# Altium schematic sheet Anemometor_ResDiv1.SchDoc
size 152 x 127 mm; SheetNumber: 7; SheetTotal: 11
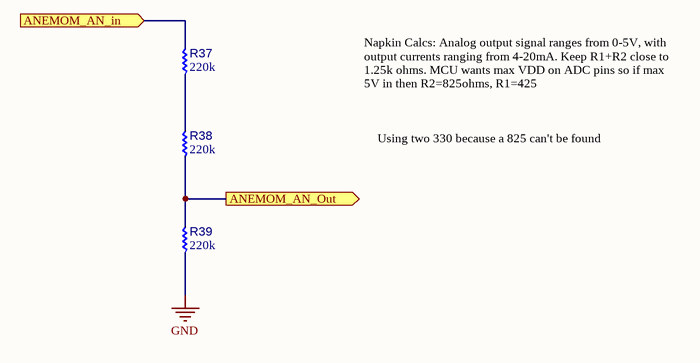
[diagram p0: Anemometor_ResDiv1.SchDoc]

## Parts
R37  value 220k  [New footprint 1]  (hidden comment: RMCF0603FT220K)
R38  value 220k  [New footprint 1]  (hidden comment: RMCF0603FT220K)
R39  value 220k  [New footprint 1]  (hidden comment: RMCF0603FT220K)

## Ports
ANEMOM_AN_in (in, see TopLevel[1A]), ANEMOM_AN_Out (out, see TopLevel[1A])

## Nets
GND: R39.1
ANEMOM_AN_in: R37.2 ; port ANEMOM_AN_in
ANEMOM_AN_Out: R38.1 R39.2 ; port ANEMOM_AN_Out
NetR37_1: R37.1 R38.2

## Notes on the sheet
- Napkin Calcs: Analog output signal ranges from 0-5V, with output currents ranging from 4-20mA. Keep R1+R2 close to 1.25k ohms. MCU wants max VDD on ADC pins so if max 5V in then R2=825ohms, R1=425
- Using two 330 because a 825 can't be found

## Library data of the parts
R37-R39 = CMP-009-00365-1: Res Thick Film 0603 220K Ohm 1% 0.1W(1/10W) ±100ppm/C Pad SMD Automotive T/R; Voltage Rating: 75V; Tolerance: 1%; Min Operating Temperature: -55°C; Mounting Technology: Surface Mount; Case/Package: 0603; Max Operating Temperature: 155°C